# EAGLE design Step-to-Talk V2 Jig BOTTOM (EAGLE 8.4.2)
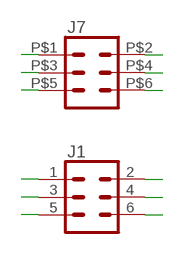
[diagram p0: schematic, sheet 1]

## Parts
J1  CONN_03X2NO_SILK  [2X3-NS]
J7  CONN_03X2POGO_PINS  [2X3_POGO]

## Nets
GND: J1.6 J7.P$5
MISO: J1.1 J7.P$2
MOSI: J1.4 J7.P$3
RST: J1.5 J7.P$6
SCK: J1.3 J7.P$4
VCC: J1.2 J7.P$1

## Library data of the parts
J1 = SparkFun-Connectors:CONN_03X2: Multi connection point. Often used as Generic Header-pin footprint for 0.1 inch spaced/style header connections You can populate with any combo of single row headers, but if you'd like an exact match, check these: Header - 2x3 (Male, 0.1") <https://www.sparkfun.com/products/12807> (PRT-12807) Header - 2x3 (Female, 0.1") <https://www.sparkfun.com/products/13010> (PRT-13010) 2x3 Pin Shrouded Header <https://www.sparkfun.com/products/10877> (PRT-10877) On any of the 0.1 inch spaced packages, you can populate with these: Break Away Headers - Straight <https://www.sparkfun.com/products/116> (PRT-00116) Break Away Male Headers - Right Angle <https://www.sparkfun.com/products/553> (PRT-00553) Female Headers <https://www.sparkfun.com/products/115> (PRT-00115) Break Away Headers - Machine Pin <https://www.sparkfun.com/products/117> (PRT-00117) Break Away Female Headers - Swiss Machine Pin <https://www.sparkfun.com/products/743> (PRT-00743) Special note: the shrouded connector mates well with our 3x2 ribbon cables: Ribbon Crimp Connector - 6-pin (2x3, Female) <https://www.sparkfun.com/products/10651> (PRT-10651) Ribbon Cable - 6 wire (15ft) <https://www.sparkfun.com/products/10646> (PRT-10646)
J7 = SparkFun-Connectors:CONN_03X2: Multi connection point. Often used as Generic Header-pin footprint for 0.1 inch spaced/style header connections You can populate with any combo of single row headers, but if you'd like an exact match, check these: Header - 2x3 (Male, 0.1") <https://www.sparkfun.com/products/12807> (PRT-12807) Header - 2x3 (Female, 0.1") <https://www.sparkfun.com/products/13010> (PRT-13010) 2x3 Pin Shrouded Header <https://www.sparkfun.com/products/10877> (PRT-10877) On any of the 0.1 inch spaced packages, you can populate with these: Break Away Headers - Straight <https://www.sparkfun.com/products/116> (PRT-00116) Break Away Male Headers - Right Angle <https://www.sparkfun.com/products/553> (PRT-00553) Female Headers <https://www.sparkfun.com/products/115> (PRT-00115) Break Away Headers - Machine Pin <https://www.sparkfun.com/products/117> (PRT-00117) Break Away Female Headers - Swiss Machine Pin <https://www.sparkfun.com/products/743> (PRT-00743) Special note: the shrouded connector mates well with our 3x2 ribbon cables: Ribbon Crimp Connector - 6-pin (2x3, Female) <https://www.sparkfun.com/products/10651> (PRT-10651) Ribbon Cable - 6 wire (15ft) <https://www.sparkfun.com/products/10646> (PRT-10646); PROD_ID: HW-11044

## Board
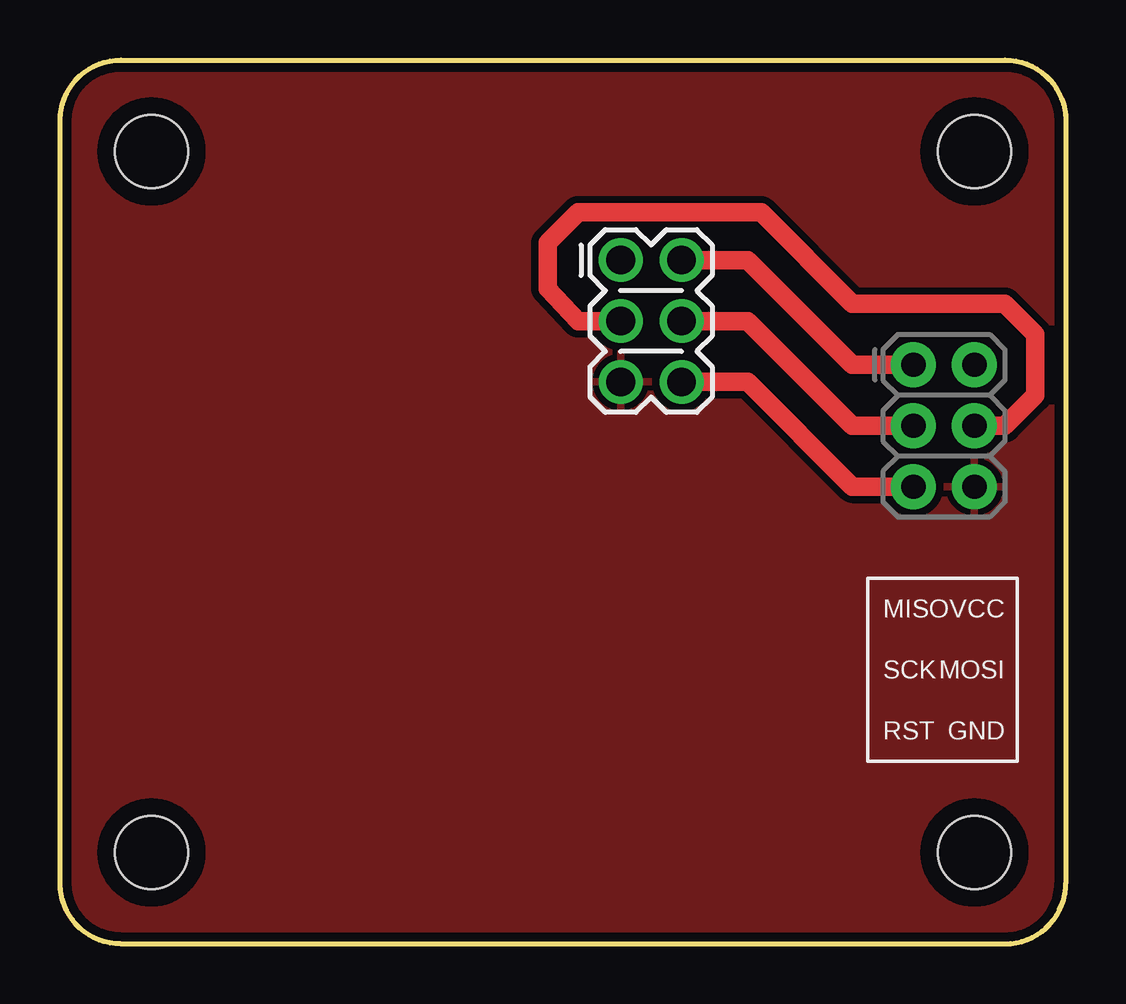
[diagram p1: board, top side]
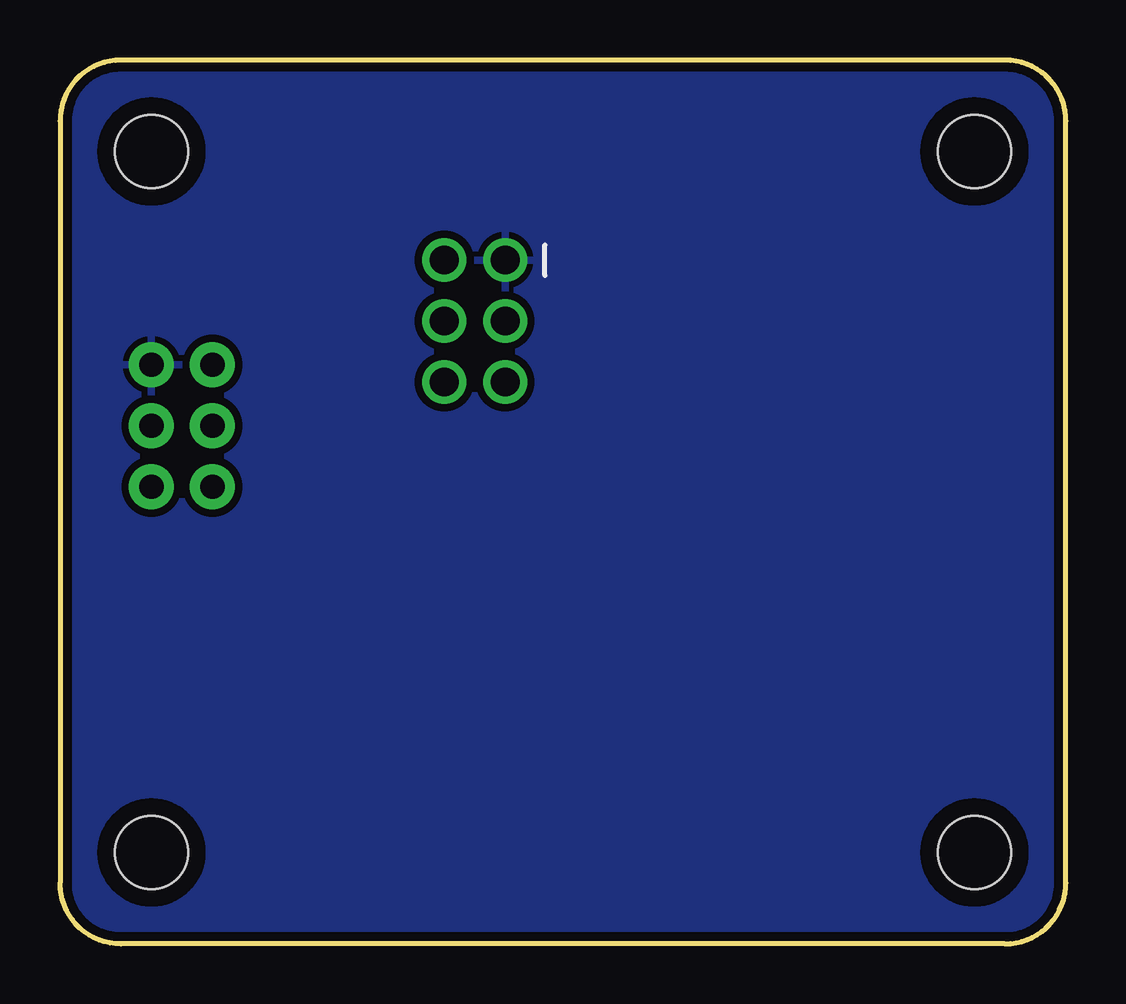
[diagram p2: board, bottom side, seen from below]

Size 41.91 x 36.83 mm. Coordinates in mm from the lower left corner, seen from the top.
Outline: 41.91,34.29 41.91,2.54 arc-90 39.37,0 2.54,0 arc-90 0,2.54 0,34.29 arc-90 2.54,36.83 39.37,36.83 arc-90 41.91,34.29
Copper layers (1*16): Top 0.035559375mm / dielectric 1.6mm / Bottom 0.035559375mm
Design rules "oshpark-2layer-tented": minimum track width 6mil, minimum drill 10mil, track to track 6mil, track to pad 6mil, pad to pad 6mil, via to via 6mil, smd to smd 6mil, copper to edge 15mil, drill to drill 6mil, minimum pad ring 5mil, minimum via ring 5mil, stop-mask expansion 2.5mil, vias tented up to drill 20mil, thermal gap 10mil

### Footprints (pad centres in the part's own frame; a part is rotated, then mirrored left to right if it is on the bottom)
2X3-NS = drill 1.016 pad 1.88: 1 -2.54,-1.27; 2 -2.54,1.27; 3 0,-1.27; 4 0,1.27; 5 2.54,-1.27; 6 2.54,1.27
2X3_POGO = drill 1.2 pad 1.829: P$1 0,0; P$2 0,2.54; P$3 2.54,0; P$4 2.54,2.54; P$5 5.08,0; P$6 5.08,2.54
STAND-OFF-TIGHT = hole 3.048: 0,0

### Placement (x,y rotation side)
J1  36.83,21.59 270 top
J7  23.36,28.5 270 top
U$1  [STAND-OFF-TIGHT]  3.81,33.02 0 top
U$2  [STAND-OFF-TIGHT]  3.81,3.81 0 top
U$3  [STAND-OFF-TIGHT]  38.1,33.02 0 top
U$4  [STAND-OFF-TIGHT]  38.1,3.81 0 top

### Tracks (layer width: path | path; a pad name or v marks a point on that pad's centre or on a via)
GND
  pour Top (isolate 0.305): 0,36.83 41.91,36.83 41.91,0 0,0
MISO
  Top 0.762: J7.P$2 28.66,28.5 33.02,24.13 J1.1
MOSI
  Top 0.762: J1.4 39.37,21.59 40.64,22.86 40.64,25.4 39.37,26.67 33.02,26.67 29.21,30.48 21.59,30.48 20.32,29.21 20.32,27.3 21.59,25.95 J7.P$3
RST
  Top 0.762: J7.P$6 28.66,23.41 33.02,19.05 J1.5
SCK
  Top 0.762: J7.P$4 28.66,25.95 33.02,21.59 J1.3
VCC
  pour Bottom (isolate 0.305): 0,36.83 41.91,36.83 41.91,0 0,0

### Text on the board
tNames: MISO | VCC | SCK | MOSI | RST | GND